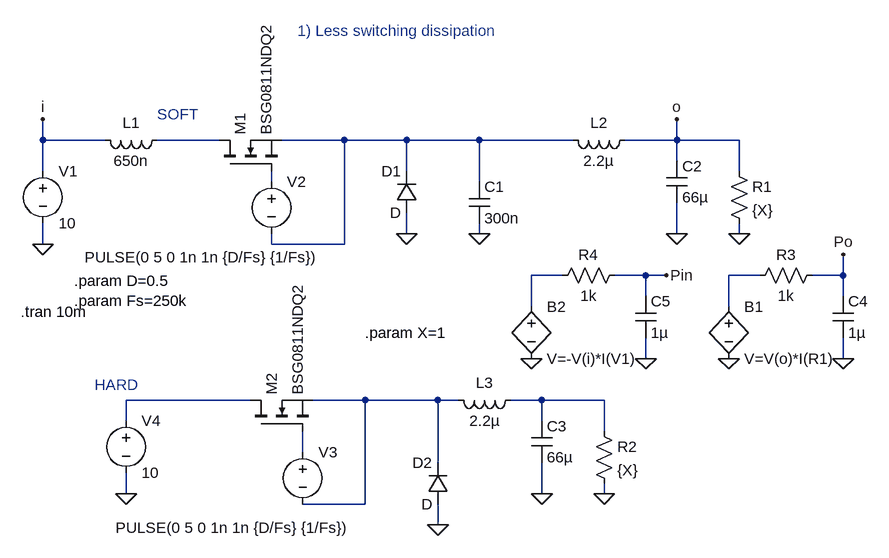
[diagram p0: schematic ZVS Buck.asc]
ZVS Buck.asc, the LTspice schematic file:
Version 4
SHEET 1 1224 692
WIRE -80 80 -80 48
WIRE 16 80 -80 80
WIRE 192 80 96 80
WIRE 384 80 288 80
WIRE 480 80 384 80
WIRE 592 80 480 80
WIRE 736 80 592 80
WIRE 896 80 896 48
WIRE 896 80 816 80
WIRE 992 80 896 80
WIRE 896 112 896 80
WIRE -80 128 -80 80
WIRE 480 128 480 80
WIRE 992 128 992 80
WIRE 272 144 272 128
WIRE 592 144 592 80
WIRE 480 224 480 192
WIRE 592 224 592 208
WIRE 896 224 896 176
WIRE 992 224 992 208
WIRE -80 240 -80 208
WIRE 272 240 272 224
WIRE 384 240 384 80
WIRE 384 240 272 240
WIRE 720 288 672 288
WIRE 848 288 800 288
WIRE 880 288 848 288
WIRE 1024 288 976 288
WIRE 1152 288 1152 256
WIRE 1152 288 1104 288
WIRE 848 320 848 288
WIRE 1152 320 1152 288
WIRE 672 336 672 288
WIRE 976 336 976 288
WIRE 848 416 848 384
WIRE 1152 416 1152 384
WIRE 240 480 48 480
WIRE 416 480 336 480
WIRE 528 480 416 480
WIRE 560 480 528 480
WIRE 688 480 640 480
WIRE 784 480 688 480
WIRE 48 512 48 480
WIRE 688 512 688 480
WIRE 784 528 784 480
WIRE 320 560 320 528
WIRE 528 576 528 480
WIRE 48 624 48 592
WIRE 688 624 688 576
WIRE 784 624 784 608
WIRE 416 640 416 480
WIRE 416 640 320 640
WIRE 528 672 528 640
FLAG -80 240 0
FLAG 592 224 0
FLAG 480 224 0
FLAG 896 224 0
FLAG 992 224 0
FLAG 528 672 0
FLAG 688 624 0
FLAG 784 624 0
FLAG 48 624 0
FLAG 896 48 o
FLAG -80 48 i
FLAG 1152 416 0
FLAG 976 416 0
FLAG 848 416 0
FLAG 672 416 0
FLAG 880 288 Pin
FLAG 1152 256 Po
SYMBOL voltage -80 112 R0
SYMATTR InstName V1
SYMATTR Value 10
SYMBOL ind 112 64 R90
WINDOW 0 5 56 VBottom 2
WINDOW 3 32 56 VTop 2
SYMATTR InstName L1
SYMATTR Value 650n
SYMBOL cap 576 144 R0
SYMATTR InstName C1
SYMATTR Value 300n
SYMBOL nmos 192 128 R270
SYMATTR InstName M1
SYMATTR Value BSG0811NDQ2
SYMBOL diode 496 192 R180
WINDOW 0 24 64 Left 2
WINDOW 3 24 0 Left 2
SYMATTR InstName D1
SYMBOL voltage 272 128 R0
WINDOW 3 -288 132 Left 2
WINDOW 123 0 0 Left 0
WINDOW 39 0 0 Left 0
SYMATTR InstName V2
SYMATTR Value PULSE(0 5 0 1n 1n {D/Fs} {1/Fs})
SYMBOL ind 832 64 R90
WINDOW 0 5 56 VBottom 2
WINDOW 3 32 56 VTop 2
SYMATTR InstName L2
SYMATTR Value 2.2µ
SYMBOL cap 880 112 R0
SYMATTR InstName C2
SYMATTR Value 66µ
SYMBOL res 976 112 R0
SYMATTR InstName R1
SYMATTR Value {X}
SYMBOL nmos 240 528 R270
SYMATTR InstName M2
SYMATTR Value BSG0811NDQ2
SYMBOL diode 544 640 R180
WINDOW 0 24 64 Left 2
WINDOW 3 24 0 Left 2
SYMATTR InstName D2
SYMBOL voltage 320 544 R0
WINDOW 3 -288 132 Left 2
WINDOW 123 0 0 Left 0
WINDOW 39 0 0 Left 0
SYMATTR InstName V3
SYMATTR Value PULSE(0 5 0 1n 1n {D/Fs} {1/Fs})
SYMBOL voltage 48 496 R0
SYMATTR InstName V4
SYMATTR Value 10
SYMBOL ind 656 464 R90
WINDOW 0 5 56 VBottom 2
WINDOW 3 32 56 VTop 2
SYMATTR InstName L3
SYMATTR Value 2.2µ
SYMBOL cap 672 512 R0
SYMATTR InstName C3
SYMATTR Value 66µ
SYMBOL res 768 512 R0
SYMATTR InstName R2
SYMATTR Value {X}
SYMBOL bv 976 320 R0
SYMATTR InstName B1
SYMATTR Value V=V(o)*I(R1)
SYMBOL res 1120 272 R90
WINDOW 0 0 56 VBottom 2
WINDOW 3 32 56 VTop 2
SYMATTR InstName R3
SYMATTR Value 1k
SYMBOL cap 1136 320 R0
SYMATTR InstName C4
SYMATTR Value 1µ
SYMBOL bv 672 320 R0
SYMATTR InstName B2
SYMATTR Value V=-V(i)*I(V1)
SYMBOL res 816 272 R90
WINDOW 0 0 56 VBottom 2
WINDOW 3 32 56 VTop 2
SYMATTR InstName R4
SYMATTR Value 1k
SYMBOL cap 832 320 R0
SYMATTR InstName C5
SYMATTR Value 1µ
TEXT -32 296 Left 2 !.param D=0.5\n.param Fs=250k
TEXT -114 344 Left 2 !.tran 10m
TEXT 312 -88 Left 2 ;1) Less switching dissipation
TEXT 416 376 Left 2 !.param X=1
TEXT 0 456 Left 2 ;HARD
TEXT 96 40 Left 2 ;SOFT

The netlist it stands for:
* ZVS Buck.asc
V1 i 0 10
L1 N001 i 650n
C1 N002 0 300n
M1 N001 N003 N002 N002 BSG0811NDQ2
D1 0 N002 D
V2 N003 N002 PULSE(0 5 0 1n 1n {D/Fs} {1/Fs})
L2 o N002 2.2µ
C2 o 0 66µ
R1 o 0 {X}
M2 N006 N009 N007 N007 BSG0811NDQ2
D2 0 N007 D
V3 N009 N007 PULSE(0 5 0 1n 1n {D/Fs} {1/Fs})
V4 N006 0 10
L3 N008 N007 2.2µ
C3 N008 0 66µ
R2 N008 0 {X}
B1 N005 0 V=V(o)*I(R1)
R3 Po N005 1k
C4 Po 0 1µ
B2 N004 0 V=-V(i)*I(V1)
R4 Pin N004 1k
C5 Pin 0 1µ
.model D D
.lib standard.dio
.model NMOS NMOS
.model PMOS PMOS
.lib standard.mos
.param D=0.5
.param Fs=250k
.tran 10m
* 1) Less switching dissipation
.param X=1
* HARD
* SOFT
.backanno
.end